# Altium schematic sheet 6301 Lab3 PTAT.SchDoc: PTAT Temp Sensor
size Letter; Author: M. Holachek; Revision: 1; SheetNumber: 2; SheetTotal: 3
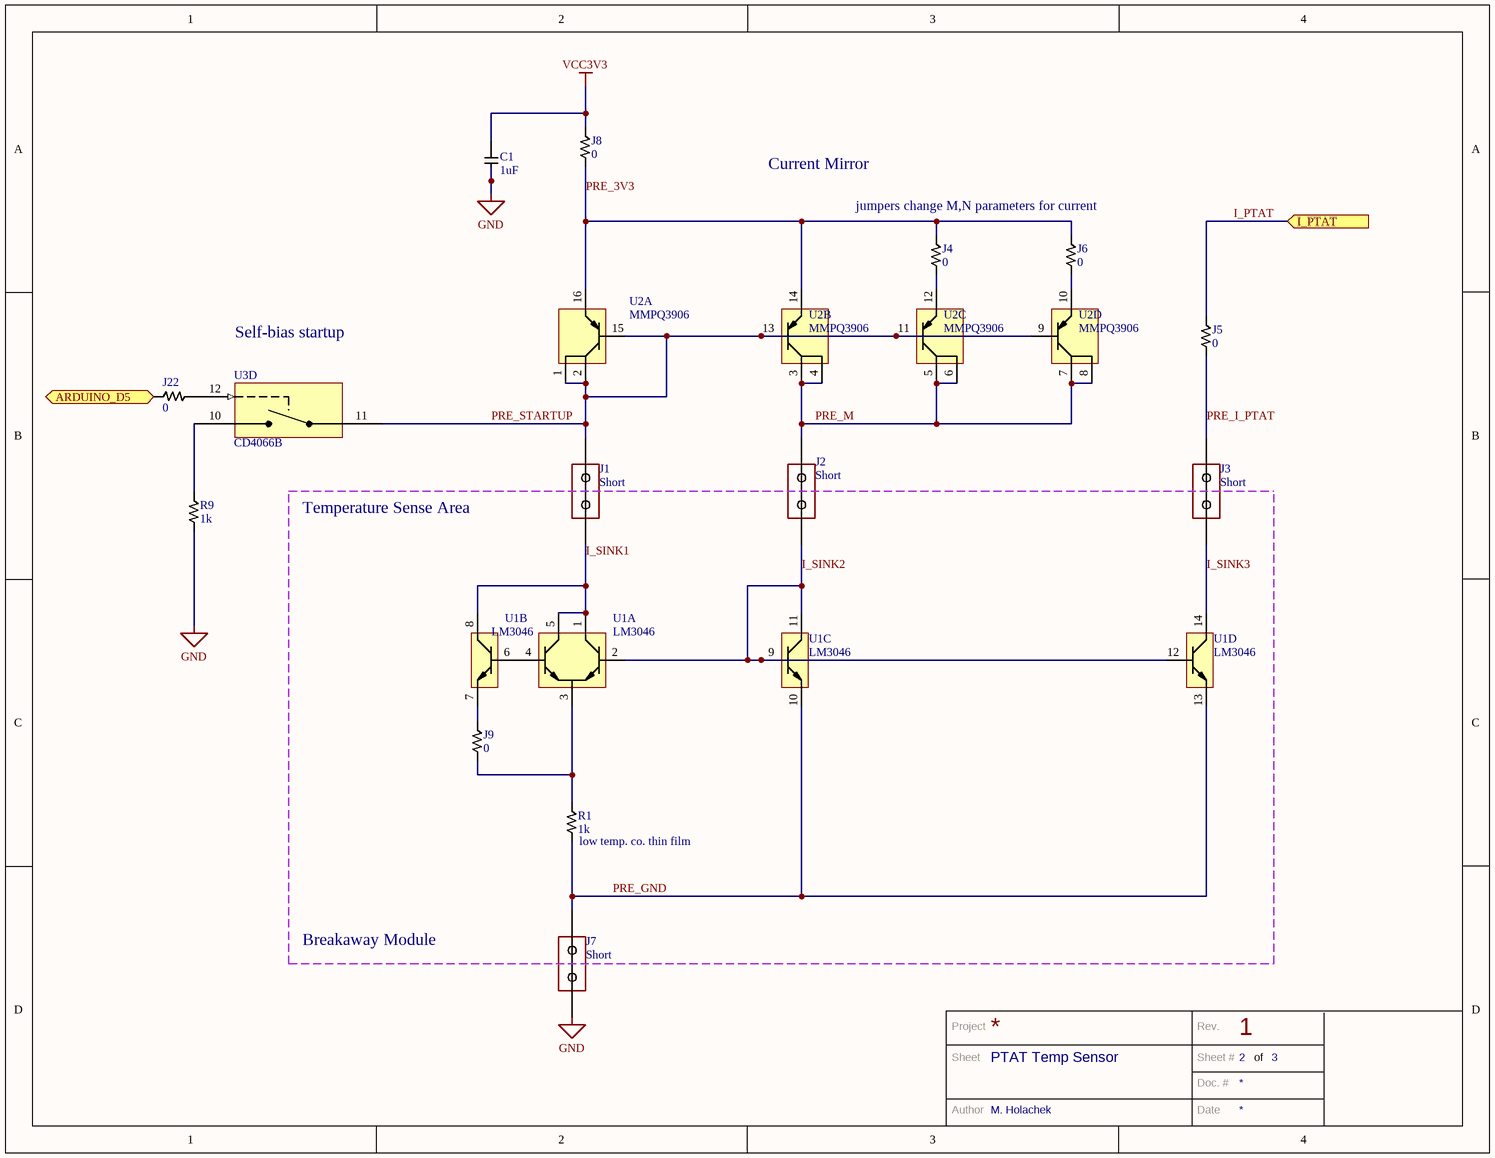
[diagram p0: 6301 Lab3 PTAT.SchDoc]

## Parts
C1  1uF  [CAP0805]
J1  Short  [1X02_SHORT]
J2  Short  [1X02_SHORT]
J3  Short  [1X02_SHORT]
J4  0  [JUMP0402]
J5  0  [JUMP0402]
J6  0  [JUMP0402]
J7  Short  [1X02_SHORT]
J8  0  [JUMP0402]
J9  0  [JUMP0402]
J22  0  [JUMP0402]
R1  1k  [RES0805]
R9  1k  [RES0805]
U1  LM3046  [SOIC14]  (parts A,B,C,D of 4)
U2  MMPQ3906  [SOIC16]  (parts A,B,C,D of 4)
U3  CD4066B  [SOIC14]  (part D of 4)

## Ports
ARDUINO_D5, I_PTAT (in)

## Nets
GND: C1.1 J7.1 R9.1
VCC3V3: C1.2 J8.2
ARDUINO_D5: J22.1 ; port ARDUINO_D5
I_PTAT: J5.2 ; port I_PTAT
I_SINK1: J1.1 U1.1(Q1AC) U1.5(Q1BC) U1.8(Q2C)
I_SINK2: J2.2 U1.2(Q1AB) U1.9(Q3B) U1.11(Q3C) U1.12(Q4B)
I_SINK3: J3.1 U1.14(Q4C)
PRE_3V3: J4.2 J6.2 J8.1 U2.14(Q2E) U2.16(Q1E)
PRE_GND: J7.2 R1.1 U1.10(Q3E) U1.13(Q4E)
PRE_I_PTAT: J3.2 J5.1
PRE_M: J2.1 U2.3(Q2C) U2.4(Q1C) U2.5(Q3C) U2.6(Q1C) U2.7(Q4C) U2.8(Q1C)
PRE_STARTUP: J1.2 U2.1(Q1C) U2.2(Q1C) U2.9(Q4B) U2.11(Q3B) U2.13(Q2B) U2.15(Q1B) U3.11(IN_D)
NetJ4_1: J4.1 U2.12(Q3E)
NetJ6_1: J6.1 U2.10(Q4E)
NetJ9_1: J9.1 R1.2 U1.3(Q1E)
NetJ9_2: J9.2 U1.7(Q2E)
NetJ22_2: J22.2 U3.12(EN_D)
NetR9_2: R9.2 U3.10(OUT_D)
NetU1_4: U1.4(Q1BB) U1.6(Q2B)

## Notes on the sheet
- Current Mirror
- jumpers change M,N parameters for current
- Self-bias startup
- Temperature Sense Area
- (near R1) low temp. co. thin film
- Breakaway Module
- Project
- Rev.
- Sheet
- Author
- Doc. #
- Sheet #
- Date
- of

## Library data of the parts
C1 = Capacitor: Capacitor, 0805 Package; Tolerance: 10%; Type: Ceramic; Voltage: 25V
J1-J3 J7 = 1x2 Wide Short: Shorted TH pins in wide configuration
J4-J6 J8 J9 J22 = Jumper 0402: Jumper, 0402 Package
R1 = Resistor: Resistor, 0805 Package; Temp Co: +/- 25ppm; Tolerance: 0.1%; Digikey P/N: P499DACT-ND
R9 = Resistor: Resistor, 0805 Package; Temp Co: +/- 100ppm; Tolerance: 1%; Digikey P/N: 311-1.00KCRCT-ND
U1 = LM3046: NPN Silicon Quad Transistor Array
U2 = MMPQ3906: PNP Silicon Quad Transistor Array
U3 = CD4066B: CMOS Quad Bilateral Switch; Manufacturer P/N: CD4066BEE4; Manufacturer: Texas Instruments; Current Rating: 10mA; Output Voltage Range: 3-18V; Operating Temperature: -55C to 125C; Digikey P/N: 296-36088-5-ND